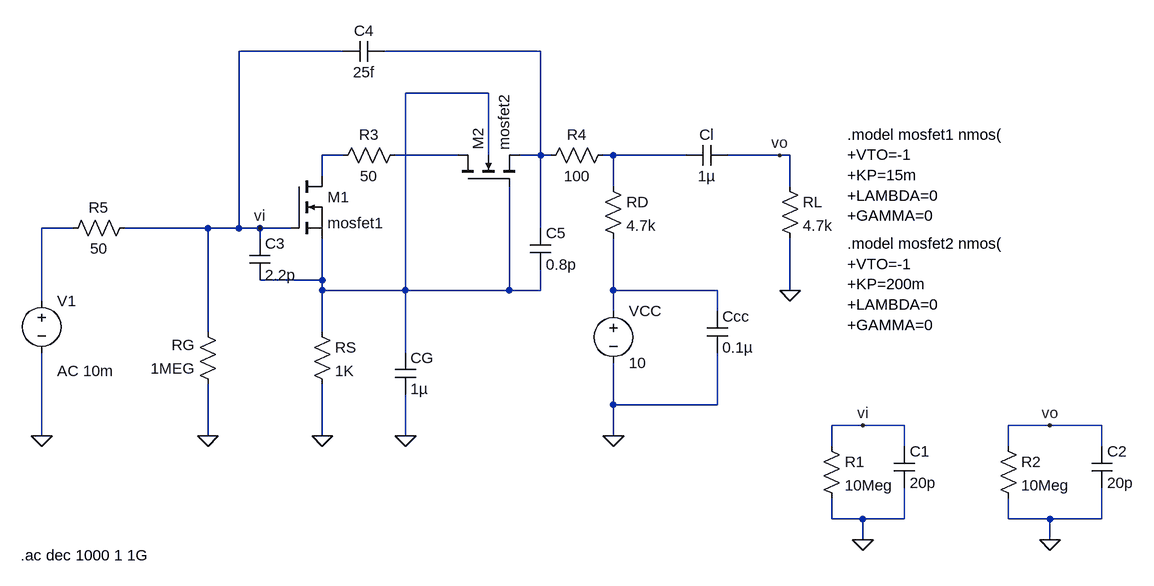
[diagram p0: schematic Punta_X10.asc]
Punta_X10.asc, the LTspice schematic file:
Version 4
SHEET 1 2100 680
WIRE 240 -240 80 -240
WIRE 544 -240 304 -240
WIRE 464 -176 336 -176
WIRE 240 -80 208 -80
WIRE 416 -80 320 -80
WIRE 464 -80 464 -176
WIRE 544 -80 544 -240
WIRE 544 -80 512 -80
WIRE 560 -80 544 -80
WIRE 656 -80 640 -80
WIRE 768 -80 656 -80
WIRE 912 -80 832 -80
WIRE 928 -80 912 -80
WIRE 208 -48 208 -80
WIRE 656 -32 656 -80
WIRE 928 -32 928 -80
WIRE -176 32 -224 32
WIRE 32 32 -96 32
WIRE 80 32 80 -240
WIRE 80 32 32 32
WIRE 112 32 80 32
WIRE 160 32 112 32
WIRE 544 32 544 -80
WIRE 112 48 112 32
WIRE 208 112 208 48
WIRE 208 112 112 112
WIRE 208 128 208 112
WIRE 336 128 336 -176
WIRE 336 128 208 128
WIRE 496 128 496 -32
WIRE 496 128 336 128
WIRE 544 128 544 96
WIRE 544 128 496 128
WIRE 656 128 656 48
WIRE 816 128 656 128
WIRE 928 128 928 48
WIRE -224 144 -224 32
WIRE 656 160 656 128
WIRE 816 160 816 128
WIRE 32 192 32 32
WIRE 208 192 208 128
WIRE 336 224 336 128
WIRE 656 304 656 240
WIRE 816 304 816 224
WIRE 816 304 656 304
WIRE 1040 336 992 336
WIRE 1104 336 1040 336
WIRE 1328 336 1264 336
WIRE 1408 336 1328 336
WIRE -224 352 -224 224
WIRE 32 352 32 272
WIRE 208 352 208 272
WIRE 336 352 336 288
WIRE 656 352 656 304
WIRE 992 368 992 336
WIRE 1104 368 1104 336
WIRE 1264 368 1264 336
WIRE 1408 368 1408 336
WIRE 992 480 992 448
WIRE 1040 480 992 480
WIRE 1104 480 1104 432
WIRE 1104 480 1040 480
WIRE 1264 480 1264 448
WIRE 1328 480 1264 480
WIRE 1408 480 1408 432
WIRE 1408 480 1328 480
WIRE 1040 512 1040 480
WIRE 1328 512 1328 480
FLAG 32 352 0
FLAG 208 352 0
FLAG 656 352 0
FLAG 336 352 0
FLAG 928 128 0
FLAG 912 -80 vo
FLAG -224 352 0
FLAG 112 32 vi
FLAG 1040 512 0
FLAG 1328 512 0
FLAG 1040 336 vi
FLAG 1328 336 vo
SYMBOL res 48 288 R180
WINDOW 0 36 76 Left 2
WINDOW 3 36 40 Left 2
SYMATTR InstName RG
SYMATTR Value 1MEG
SYMBOL res 192 176 R0
SYMATTR InstName RS
SYMATTR Value 1K
SYMBOL nmos4 416 -32 R270
SYMATTR InstName M2
SYMATTR Value mosfet2
SYMBOL res 640 -48 R0
SYMATTR InstName RD
SYMATTR Value 4.7k
SYMBOL voltage 656 144 R0
SYMATTR InstName VCC
SYMATTR Value 10
SYMBOL nmos 160 -48 R0
SYMATTR InstName M1
SYMATTR Value mosfet1
SYMBOL cap 320 224 R0
SYMATTR InstName CG
SYMATTR Value 1µ
SYMBOL cap 800 160 R0
SYMATTR InstName Ccc
SYMATTR Value 0.1µ
SYMBOL cap 832 -96 R90
WINDOW 0 0 32 VBottom 2
WINDOW 3 32 32 VTop 2
SYMATTR InstName Cl
SYMATTR Value 1µ
SYMBOL res 912 -48 R0
SYMATTR InstName RL
SYMATTR Value 4.7k
SYMBOL voltage -224 128 R0
WINDOW 123 24 124 Left 2
WINDOW 39 0 0 Left 2
SYMATTR Value2 AC 10m
SYMATTR InstName V1
SYMATTR Value ""
SYMBOL res 976 352 R0
SYMATTR InstName R1
SYMATTR Value 10Meg
SYMBOL cap 1088 368 R0
SYMATTR InstName C1
SYMATTR Value 20p
SYMBOL res 1248 352 R0
SYMATTR InstName R2
SYMATTR Value 10Meg
SYMBOL cap 1392 368 R0
SYMATTR InstName C2
SYMATTR Value 20p
SYMBOL res 336 -96 R90
WINDOW 0 0 56 VBottom 2
WINDOW 3 32 56 VTop 2
SYMATTR InstName R3
SYMATTR Value 50
SYMBOL res 656 -96 R90
WINDOW 0 0 56 VBottom 2
WINDOW 3 32 56 VTop 2
SYMATTR InstName R4
SYMATTR Value 100
SYMBOL cap 96 48 R0
SYMATTR InstName C3
SYMATTR Value 2.2p
SYMBOL cap 304 -256 R90
WINDOW 0 0 32 VBottom 2
WINDOW 3 32 32 VTop 2
SYMATTR InstName C4
SYMATTR Value 25f
SYMBOL cap 528 32 R0
SYMATTR InstName C5
SYMATTR Value 0.8p
SYMBOL res -80 16 R90
WINDOW 0 0 56 VBottom 2
WINDOW 3 32 56 VTop 2
SYMATTR InstName R5
SYMATTR Value 50
TEXT 1016 -112 Left 2 !.model mosfet1 nmos( \n+VTO=-1 \n+KP=15m \n+LAMBDA=0 \n+GAMMA=0
TEXT 1016 56 Left 2 !.model mosfet2 nmos( \n+VTO=-1 \n+KP=200m \n+LAMBDA=0 \n+GAMMA=0
TEXT -256 536 Left 2 !.ac dec 1000 1 1G

The netlist it stands for:
* Punta_X10.asc
RG 0 vi 1MEG
RS N002 0 1K
M2 N004 N002 N001 N002 mosfet2
RD N005 N007 4.7k
VCC N007 0 10
M1 N003 vi N002 N002 mosfet1
CG N002 0 1µ
Ccc N007 0 0.1µ
Cl vo N005 1µ
RL vo 0 4.7k
V1 N006 0 AC 10m
R1 vi 0 10Meg
C1 vi 0 20p
R2 vo 0 10Meg
C2 vo 0 20p
R3 N004 N003 50
R4 N005 N001 100
C3 vi N002 2.2p
C4 N001 vi 25f
C5 N001 N002 0.8p
R5 vi N006 50
.model NMOS NMOS
.model PMOS PMOS
.lib standard.mos
.model mosfet1 nmos(
+VTO=-1
+KP=15m
+LAMBDA=0
+GAMMA=0
.model mosfet2 nmos(
+VTO=-1
+KP=200m
+LAMBDA=0
+GAMMA=0
.ac dec 1000 1 1G
.backanno
.end